# Altium schematic sheet LDO.SchDoc
size 304 x 254 mm
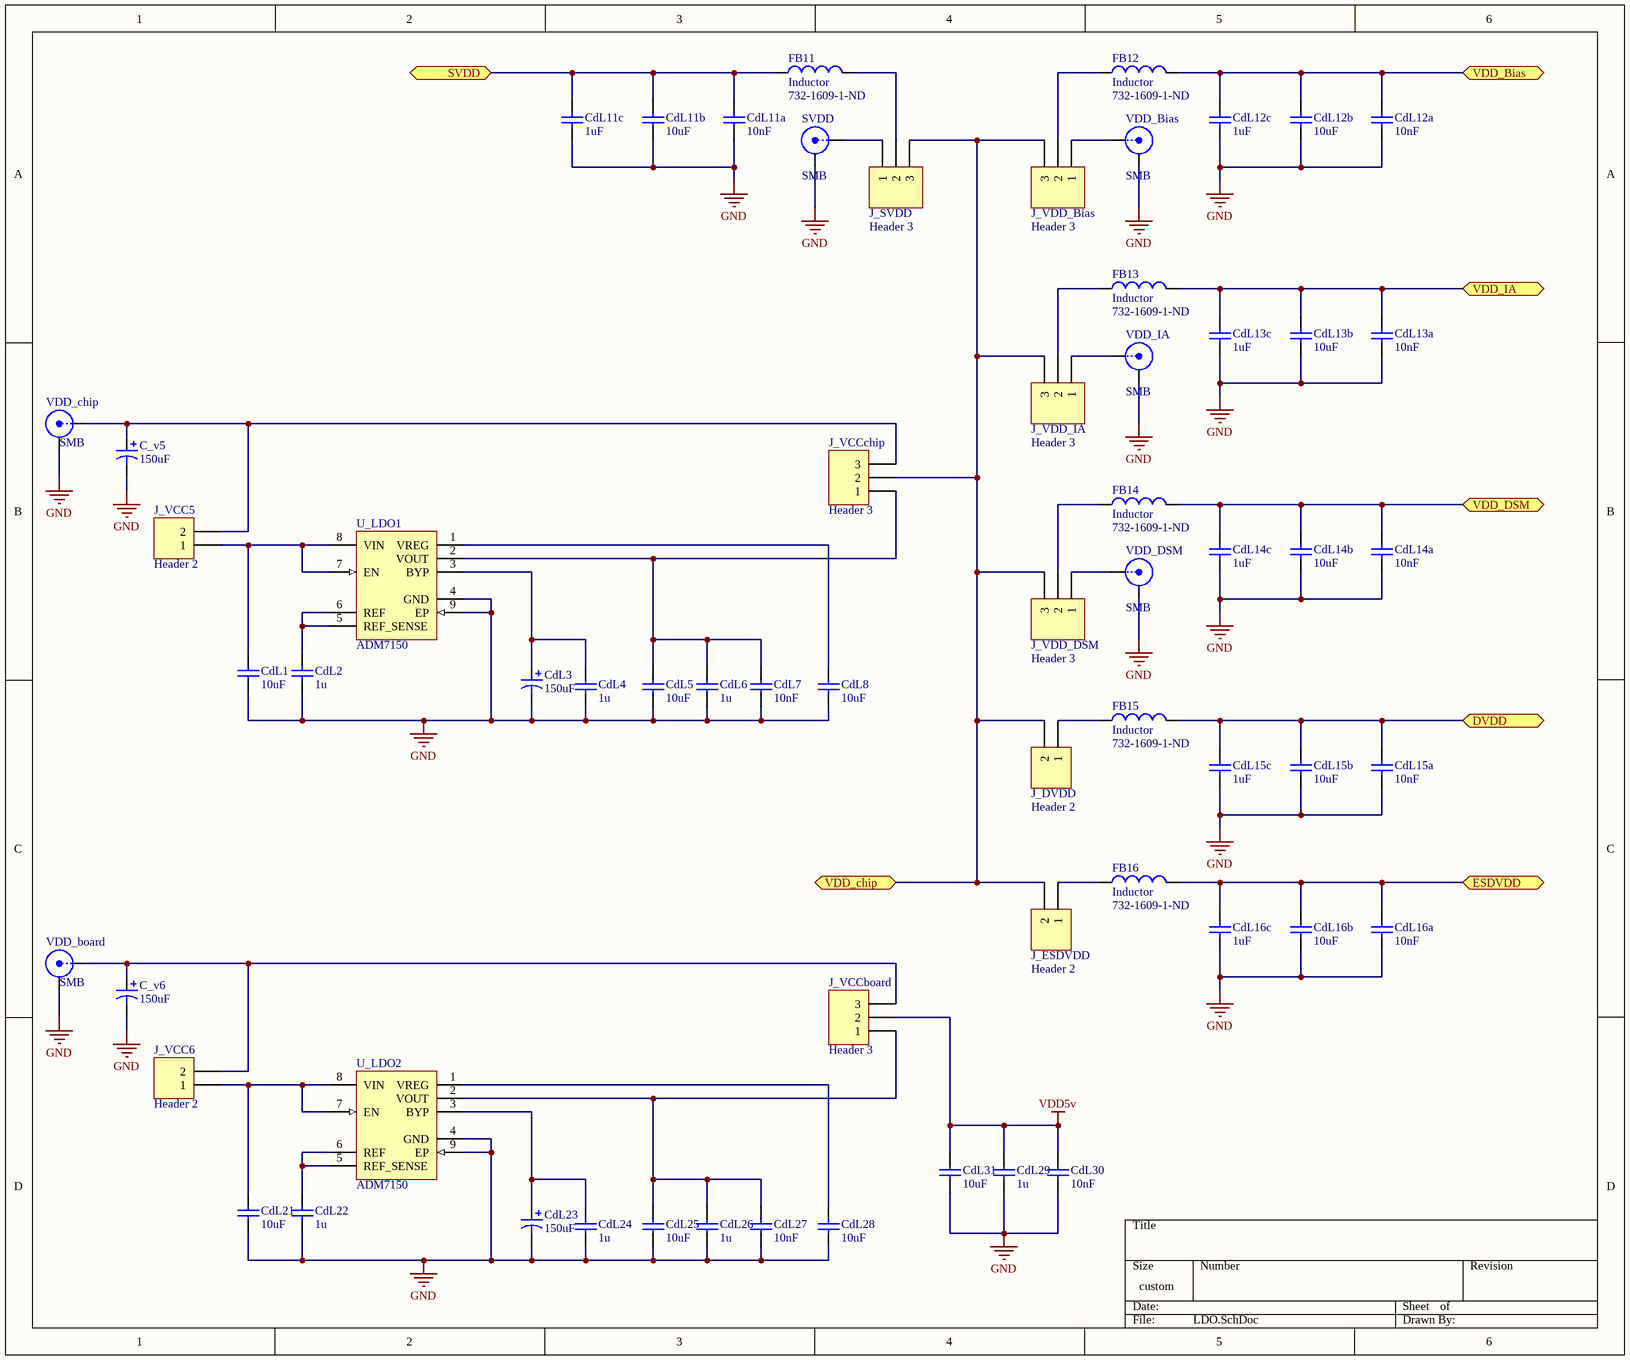
[diagram p0: LDO.SchDoc]

## Parts
C_v5  value 150uF  [C1210_M]  (hidden comment: Cap Pol1)
C_v6  value 150uF  [C1210_M]  (hidden comment: Cap Pol1)
CdL1  value 10uF  [6-0805_M]  (hidden comment: Cap)
CdL2  value 1u  [6-0805_M]  (hidden comment: Cap)
CdL3  value 150uF  [C1210_M]  (hidden comment: Cap Pol1)
CdL4  value 1u  [6-0805_M]  (hidden comment: Cap)
CdL5  value 10uF  [6-0805_M]  (hidden comment: Cap)
CdL6  value 1u  [6-0805_M]  (hidden comment: Cap)
CdL7  value 10nF  [6-0805_M]  (hidden comment: Cap)
CdL8  value 10uF  [6-0805_M]  (hidden comment: Cap)
CdL11a  value 10nF  [1608[0603]]  (hidden comment: Cap)
CdL11b  value 10uF  [1608[0603]]  (hidden comment: Cap)
CdL11c  value 1uF  [1608[0603]]  (hidden comment: Cap)
CdL12a  value 10nF  [1608[0603]]  (hidden comment: Cap)
CdL12b  value 10uF  [1608[0603]]  (hidden comment: Cap)
CdL12c  value 1uF  [1608[0603]]  (hidden comment: Cap)
CdL13a  value 10nF  [1608[0603]]  (hidden comment: Cap)
CdL13b  value 10uF  [1608[0603]]  (hidden comment: Cap)
CdL13c  value 1uF  [1608[0603]]  (hidden comment: Cap)
CdL14a  value 10nF  [1608[0603]]  (hidden comment: Cap)
CdL14b  value 10uF  [1608[0603]]  (hidden comment: Cap)
CdL14c  value 1uF  [1608[0603]]  (hidden comment: Cap)
CdL15a  value 10nF  [1608[0603]]  (hidden comment: Cap)
CdL15b  value 10uF  [1608[0603]]  (hidden comment: Cap)
CdL15c  value 1uF  [1608[0603]]  (hidden comment: Cap)
CdL16a  value 10nF  [1608[0603]]  (hidden comment: Cap)
CdL16b  value 10uF  [1608[0603]]  (hidden comment: Cap)
CdL16c  value 1uF  [1608[0603]]  (hidden comment: Cap)
CdL21  value 10uF  [6-0805_M]  (hidden comment: Cap)
CdL22  value 1u  [6-0805_M]  (hidden comment: Cap)
CdL23  value 150uF  [C1210_M]  (hidden comment: Cap Pol1)
CdL24  value 1u  [6-0805_M]  (hidden comment: Cap)
CdL25  value 10uF  [6-0805_M]  (hidden comment: Cap)
CdL26  value 1u  [6-0805_M]  (hidden comment: Cap)
CdL27  value 10nF  [6-0805_M]  (hidden comment: Cap)
CdL28  value 10uF  [6-0805_M]  (hidden comment: Cap)
CdL29  value 1u  [6-0805_M]  (hidden comment: Cap)
CdL30  value 10nF  [6-0805_M]  (hidden comment: Cap)
CdL31  value 10uF  [6-0805_M]  (hidden comment: Cap)
FB11  Inductor  Supplier Part Number 1: 732-1609-1-ND  [C0805]
FB12  Inductor  Supplier Part Number 1: 732-1609-1-ND  [C0805]
FB13  Inductor  Supplier Part Number 1: 732-1609-1-ND  [C0805]
FB14  Inductor  Supplier Part Number 1: 732-1609-1-ND  [C0805]
FB15  Inductor  Supplier Part Number 1: 732-1609-1-ND  [C0805]
FB16  Inductor  Supplier Part Number 1: 732-1609-1-ND  [C0805]
J_DVDD  Header 2  [HDR1X2]
J_ESDVDD  Header 2  [HDR1X2]
J_SVDD  Header 3  [HDR1X3]
J_VCC5  Header 2  [HDR1X2]
J_VCC6  Header 2  [HDR1X2]
J_VCCboard  Header 3  [HDR1X3]
J_VCCchip  Header 3  [HDR1X3]
J_VDD_Bias  Header 3  [HDR1X3]
J_VDD_DSM  Header 3  [HDR1X3]
J_VDD_IA  Header 3  [HDR1X3]
SVDD  SMB  [SMB_V-RJ45]
U_LDO1  ADM7150  [ADM7150]
U_LDO2  ADM7150  [ADM7150]
VDD_Bias  SMB  [SMB_V-RJ45]
VDD_board  SMB  [SMB_V-RJ45]
VDD_chip  SMB  [SMB_V-RJ45]
VDD_DSM  SMB  [SMB_V-RJ45]
VDD_IA  SMB  [SMB_V-RJ45]

## Ports
DVDD (bidir), ESDVDD (bidir), SVDD (bidir), VDD_Bias (bidir), VDD_chip (bidir), VDD_DSM (bidir), VDD_IA (bidir)

## Nets
GND: C_v5.2 C_v6.2 CdL1.1 CdL2.1 CdL3.2 CdL4.1 CdL5.1 CdL6.1 CdL7.1 CdL8.2 CdL11a.2 CdL11b.2 CdL11c.2 CdL12a.2 CdL12b.2 CdL12c.2 CdL13a.2 CdL13b.2 CdL13c.2 CdL14a.2 CdL14b.2 CdL14c.2 CdL15a.2 CdL15b.2 CdL15c.2 CdL16a.2 CdL16b.2 CdL16c.2 CdL21.1 CdL22.1 CdL23.2 CdL24.1 CdL25.1 CdL26.1 CdL27.1 CdL28.2 CdL29.1 CdL30.1 CdL31.1 SVDD.2(Y) U_LDO1.4(GND) U_LDO1.9(EP) U_LDO2.4(GND) U_LDO2.9(EP) VDD_Bias.2(Y) VDD_board.2(Y) VDD_chip.2(Y) VDD_DSM.2(Y) VDD_IA.2(Y)
VDD5v: CdL29.2 CdL30.2 CdL31.2 J_VCCboard.2
DVDD: CdL15a.1 CdL15b.1 CdL15c.1 FB15.2 ; port DVDD
ESDVDD: CdL16a.1 CdL16b.1 CdL16c.1 FB16.2 ; port ESDVDD
SVDD: CdL11a.1 CdL11b.1 CdL11c.1 FB11.2 ; port SVDD
VDD_Bias: CdL12a.1 CdL12b.1 CdL12c.1 FB12.2 ; port VDD_Bias
VDD_chip: J_DVDD.2 J_ESDVDD.2 J_SVDD.3 J_VCCchip.2 J_VDD_Bias.3 J_VDD_DSM.3 J_VDD_IA.3 ; port VDD_chip
VDD_DSM: CdL14a.1 CdL14b.1 CdL14c.1 FB14.2 ; port VDD_DSM
VDD_IA: CdL13a.1 CdL13b.1 CdL13c.1 FB13.2 ; port VDD_IA
NetC_v5_1: C_v5.1 J_VCC5.2 J_VCCchip.3 VDD_chip.1(X)
NetC_v6_1: C_v6.1 J_VCC6.2 J_VCCboard.3 VDD_board.1(X)
NetCdL1_2: CdL1.2 J_VCC5.1 U_LDO1.7(EN) U_LDO1.8(VIN)
NetCdL2_2: CdL2.2 U_LDO1.5(REF_SENSE) U_LDO1.6(REF)
NetCdL3_1: CdL3.1 CdL4.2 U_LDO1.3(BYP)
NetCdL5_2: CdL5.2 CdL6.2 CdL7.2 J_VCCchip.1 U_LDO1.2(VOUT)
NetCdL8_1: CdL8.1 U_LDO1.1(VREG)
NetCdL21_2: CdL21.2 J_VCC6.1 U_LDO2.7(EN) U_LDO2.8(VIN)
NetCdL22_2: CdL22.2 U_LDO2.5(REF_SENSE) U_LDO2.6(REF)
NetCdL23_1: CdL23.1 CdL24.2 U_LDO2.3(BYP)
NetCdL25_2: CdL25.2 CdL26.2 CdL27.2 J_VCCboard.1 U_LDO2.2(VOUT)
NetCdL28_1: CdL28.1 U_LDO2.1(VREG)
NetFB11_1: FB11.1 J_SVDD.2
NetFB12_1: FB12.1 J_VDD_Bias.2
NetFB13_1: FB13.1 J_VDD_IA.2
NetFB14_1: FB14.1 J_VDD_DSM.2
NetFB15_1: FB15.1 J_DVDD.1
NetFB16_1: FB16.1 J_ESDVDD.1
NetJ_SVDD_1: J_SVDD.1 SVDD.1(X)
NetJ_VDD_Bias_1: J_VDD_Bias.1 VDD_Bias.1(X)
NetJ_VDD_DSM_1: J_VDD_DSM.1 VDD_DSM.1(X)
NetJ_VDD_IA_1: J_VDD_IA.1 VDD_IA.1(X)

## Library data of the parts
C_v5 C_v6 CdL3 CdL23 = Cap Pol1: Polarized Capacitor (Radial); Published: 8-Jun-2000; LatestRevisionDate: 17-Jul-2002; LatestRevisionNote: Re-released for DXP Platform.; PackageReference: RB7.6-15; Publisher: Altium Limited; PackageDescription: Polarized Capacitor (Radial); 2 Leads; Digikey PN: 478-3349-1-ND
CdL1 CdL2 CdL4-CdL8 CdL11a CdL11b CdL11c CdL12a CdL12b CdL12c CdL13a CdL13b CdL13c CdL14a CdL14b CdL14c CdL15a CdL15b CdL15c CdL16a CdL16b CdL16c CdL21 CdL22 CdL24-CdL31 = Cap: Capacitor; Published: 8-Jun-2000; LatestRevisionDate: 17-Jul-2002; LatestRevisionNote: Re-released for DXP Platform.; PackageReference: RAD-0.3; Publisher: Altium Limited; PackageDescription: Radial Cap, Thru-Hole; 2 Leads; 0.3 in Pin Spacing
  CdL1 CdL2 CdL4-CdL8 CdL21 CdL22 CdL24-CdL31: Digikey PN: 445-1419-1-ND
  CdL11a CdL11b CdL11c CdL12a CdL12b CdL12c CdL13a CdL13b CdL13c CdL14a CdL14b CdL14c CdL15a CdL15b CdL15c CdL16a CdL16b CdL16c: Digi-Key: 445-7534-1-ND
FB11-FB16 = Inductor: Manufacturer: Wurth Electronics Inc; Manufacturer Part Number: 742792093; Code_IEC: 1005; Value: 10mH; Impedance @ Frequency: 2.2 kOhm @ 100MHz; Current Rating: 200mA; DC Resistance (DCR): 600 mOhm Max; Filter Type: Differential Mode - Single; Published: 8-Jun-2000; LatestRevisionDate: 29-May-2009; LatestRevisionNote: IPC-7351 Footprint Added.; PackageReference: 0402-A; Publisher: Altium Limited; PackageDescription: Chip Inductor; Code_JEITA: 0402; Supplier 1: Digi-Key; RoHS: RoHS Compliant; Category: Filters; Stock 1: 48274; Pricing 1: 1=0.23, 50=0.2188, 100=0.2013, 500=0.1925, 1000=0.18375, 2000=0.175 (USD); Packaging: Cut Tape (CT); Package / Case: 0805 (2012 Metric); Mounting Type: Surface Mount; Height (Max): 0.043" (1.10mm); Size / Dimension: 0.079" L x 0.047" W (2.00mm x 1.20mm); ComponentLink1URL: http://katalog.we-online.de/pbs/datasheet/742792093.pdf; ComponentLink1Description: http://katalog.we-online.de/pbs/datasheet/742792093.pdf
J_DVDD J_ESDVDD J_VCC5 J_VCC6 = Header 2: Header, 2-Pin; LatestRevisionDate: 17-Jul-2002; LatestRevisionNote: Re-released for DXP Platform.; Publisher: Altium Limited
J_SVDD J_VCCboard J_VCCchip J_VDD_Bias J_VDD_DSM J_VDD_IA = Header 3: Header, 3-Pin; LatestRevisionDate: 17-Jul-2002; LatestRevisionNote: Re-released for DXP Platform.; Publisher: Altium Limited
SVDD VDD_Bias VDD_board VDD_chip VDD_DSM VDD_IA = SMB: SMB Straight Connector; LatestRevisionDate: 17-Jul-2002; LatestRevisionNote: Re-released for DXP Platform.; Publisher: Altium Limited
U_LDO1 U_LDO2 = ADM7150: 800 mA Ultralow Noise, High PSRR, RF Linear Regulator; Manufacturer: Analog Devices; PartNumber: ADP1707ARDZ-3.3-R7; Iout max: 1A; Packing: Reel; Preset Vout Values (V): 1.8; Supply Current IGND @ Small Load: 50uA; Vin (max) (V): 5.5; Vin (min) (V): 2.5; DatasheetVersion: Rev. 0; PackageVersion: Jan-05; PackageReference: RD-8-2; PackageDescription: 8-Pin Standard Small Outline Package, Body 4.9 x 3.9 mm, Pitch 1.27 mm; Supplier 1: Digi-Key; Supplier Part Number 1: ADP1707ARDZ-3.3-R7TR-ND; Supplier 2: Digi-Key; Supplier Part Number 2: ADP1707ARDZ-3.3-R7CT-ND; Supplier 3: Digi-Key; Supplier Part Number 3: ADP1707ARDZ-3.3-R7DKR-ND; Supplier 4: Mouser; Supplier Part Number 4: 584-ADP1707ARDZ3.3R7; Mounting Technology: Surface Mount; Code_JEDEC: MS-012-AA; ComponentLink1Description: Manufacturer URL; ComponentLink1URL: http://www.analog.com/en/index.html; ComponentLink2Description: Datasheet; ComponentLink2URL: http://www.analog.com/static/imported-files/data_sheets/ADP1706_1707_1708.pdf; ComponentLink3Description: Package Specification; ComponentLink3URL: http://www.analog.com/static/imported-files/packages/62062404671038RD_8_2.pdf; ComponentLink4Description: URL Link1; ComponentLink4URL: Product URL:http://www.analog.com/en/ADP1707/productSearch.html